# EAGLE design Zx81Composite (EAGLE 9.5.2)
ZX81 Composite modification With adjustable Black Level and Line Sync Done by Thanat0s - 2020 WTFPL Licence
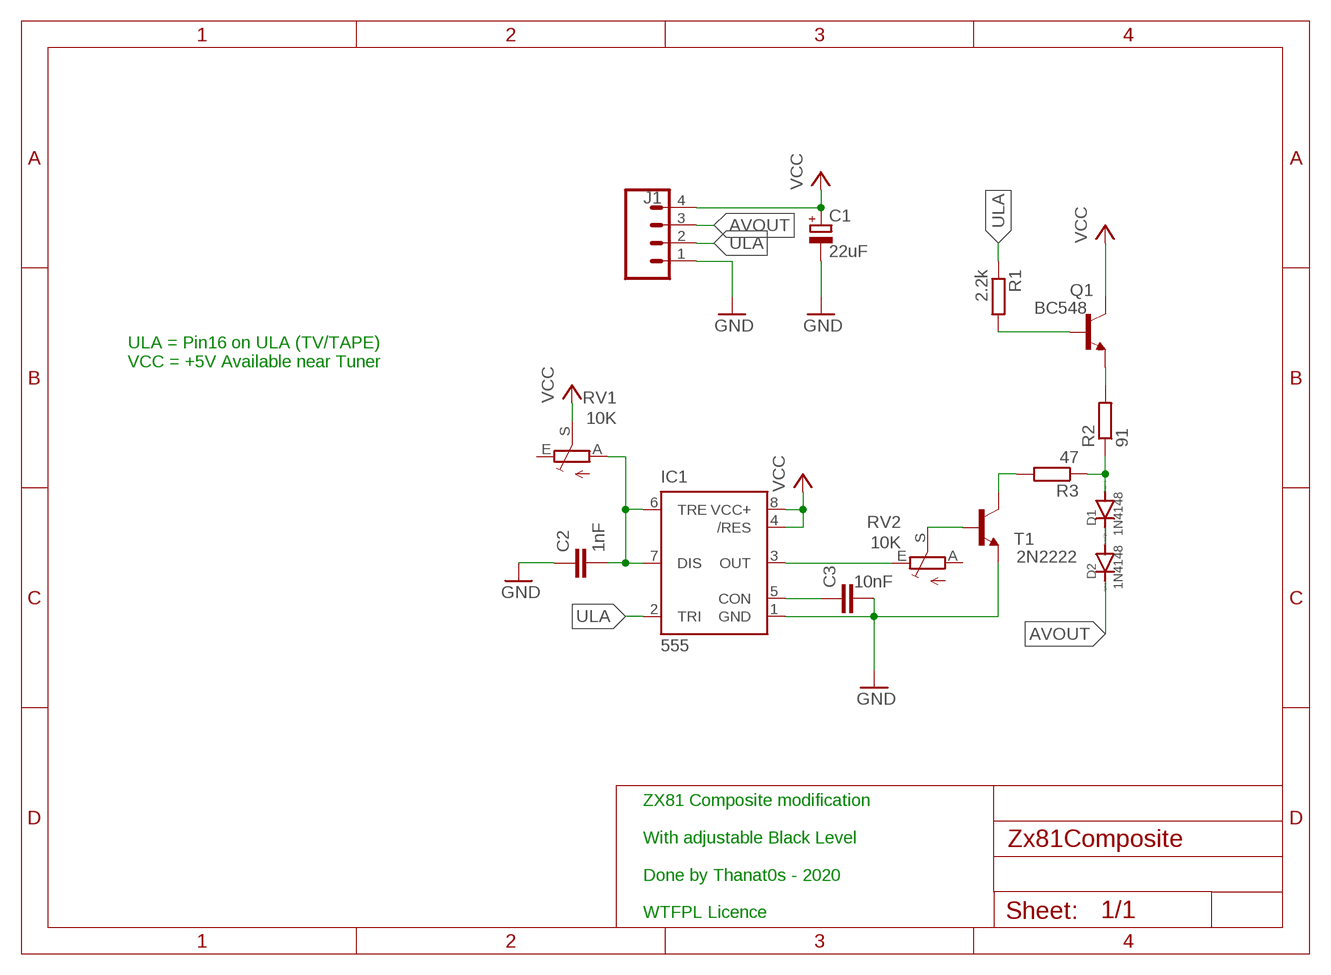
[diagram p0: schematic, sheet 1]

## Parts
C1  22uF  CPOL-EUE2.5-5  [E2,5-5]
C2  1nF  C-EU025-024X044  [C025-024X044]
C3  10nF  C-EU025-024X044  [C025-024X044]
D1  1N4148  1N4148DO35-7  [DO35-7]
D2  1N4148  1N4148DO35-7  [DO35-7]
IC1  555  555P  [DIP08]
J1  CONN_04  [1X04]
Q1  BC548  [TO92-EBC]
R1  2.2k  R-EU_0207/7  [0207/7]
R2  91  R-EU_0207/7  [0207/7]
R3  47  R-EU_0207/7  [0207/7]
RV1  10K  TRIM_EU-CA6V  [CA6V]
RV2  10K  TRIM_EU-CA6V  [CA6V]
T1  2N2222  [TO92-EBC-OVAL]

## Nets
AVOUT: D2.C J1.3
GND: C1.- C2.1 C3.2 IC1.1(GND) J1.1 T1.E
N$1: Q1.B R1.2
N$2: D1.C D2.A
N$3: RV2.S T1.B
N$4: C3.1 IC1.5(CON)
N$5: C2.2 IC1.6(TRE) IC1.7(DIS) RV1.A
N$6: IC1.3(OUT) RV2.E
N$7: D1.A R2.1 R3.1
N$8: R3.2 T1.C
N$11: Q1.E R2.2
ULA: IC1.2(TRI) J1.2 R1.1
VCC: C1.+ IC1.4(/RES) IC1.8(VCC+) J1.4 Q1.C RV1.S
Unconnected: RV1.E RV2.A

## Notes on the sheet
- ULA = Pin16 on ULA (TV/TAPE)
  VCC = +5V Available near Tuner
- ZX81 Composite modification
  
  With adjustable Black Level
  
  Done by Thanat0s - 2020
  
  WTFPL Licence

## Library data of the parts
C1 = rcl:CPOL-EU: POLARIZED CAPACITOR, European symbol; SPICEPREFIX: C
C2 C3 = rcl:C-EU: CAPACITOR, European symbol; SPICEPREFIX: C
D1 D2 = diode:1N4148: DIODE high speed (Philips)
IC1 = SparkFun-IC-Special-Function:555: General purpose bipolar Timer Datasheet <http://www.sparkfun.com/datasheets/Components/General/ne555.pdf> SparkFun Products SparkFun SparkPunk Sequencer Kit <https://www.sparkfun.com/products/12707> (KIT-12707) Storefront Component: 555 Timer <https://www.sparkfun.com/products/9273> (COM-09273) Two parts valid for production: VFP: IC-11930 (M7555 PTH) VFP: IC-09173 (555 PTH) - Preferred; PROD_ID: IC-09173; PROD_ID_ALT: IC-09173
J1 = SparkFun-Connectors:CONN_04: Multi connection point. Often used as Generic Header-pin footprint for 0.1 inch spaced/style header connections On any of the 0.1 inch spaced packages, you can populate with these: Break Away Headers - Straight <https://www.sparkfun.com/products/116> (PRT-00116) Break Away Male Headers - Right Angle <https://www.sparkfun.com/products/553> (PRT-00553) Female Headers <https://www.sparkfun.com/products/115> (PRT-00115) Break Away Headers - Machine Pin <https://www.sparkfun.com/products/117> (PRT-00117) Break Away Female Headers - Swiss Machine Pin <https://www.sparkfun.com/products/743> (PRT-00743) For SCREWTERMINALS and SPRING TERMINALS visit here: Screw Terimnals on SparkFun.com <https://www.sparkfun.com/search/results?term=Screw+Terminals> (5mm/3.5mm/2.54mm spacing) This device is also useful as a general connection point to wire up your design to another part of your project. Our various solder wires solder well into these plated through hole pads. Hook-Up Wire - Assortment (Stranded, 22 AWG) <https://www.sparkfun.com/products/11375> (PRT-11375) Hook-Up Wire - Assortment (Solid Core, 22 AWG) <https://www.sparkfun.com/products/11367> (PRT-11367) View the entire wire category on our website here <https://www.sparkfun.com/categories/141> Special notes: Molex polarized connector foot print use with SKU : PRT-08231 with associated crimp pins and housings. 1MM SMD Version SKU: PRT-10208; PROD_ID: CONN-09696
Q1 = transistor-npn:BC548*: NPN Transistor
R1-R3 = rcl:R-EU_: RESISTOR, European symbol; SPICEPREFIX: R
RV1 RV2 = pot:TRIM_EU-: POTENTIOMETER; SPICEPREFIX: J
T1 = adafruit:2N2222: NPN TRANSISTOR Big oval pads

## Board
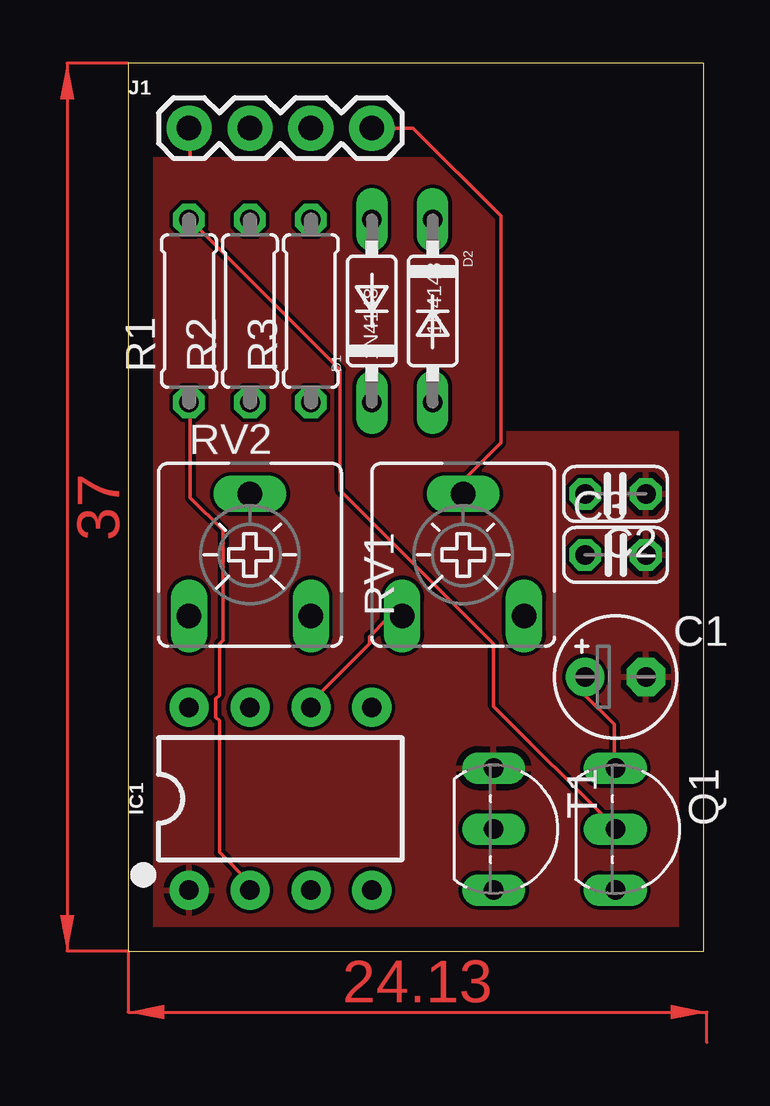
[diagram p1: board, top side]
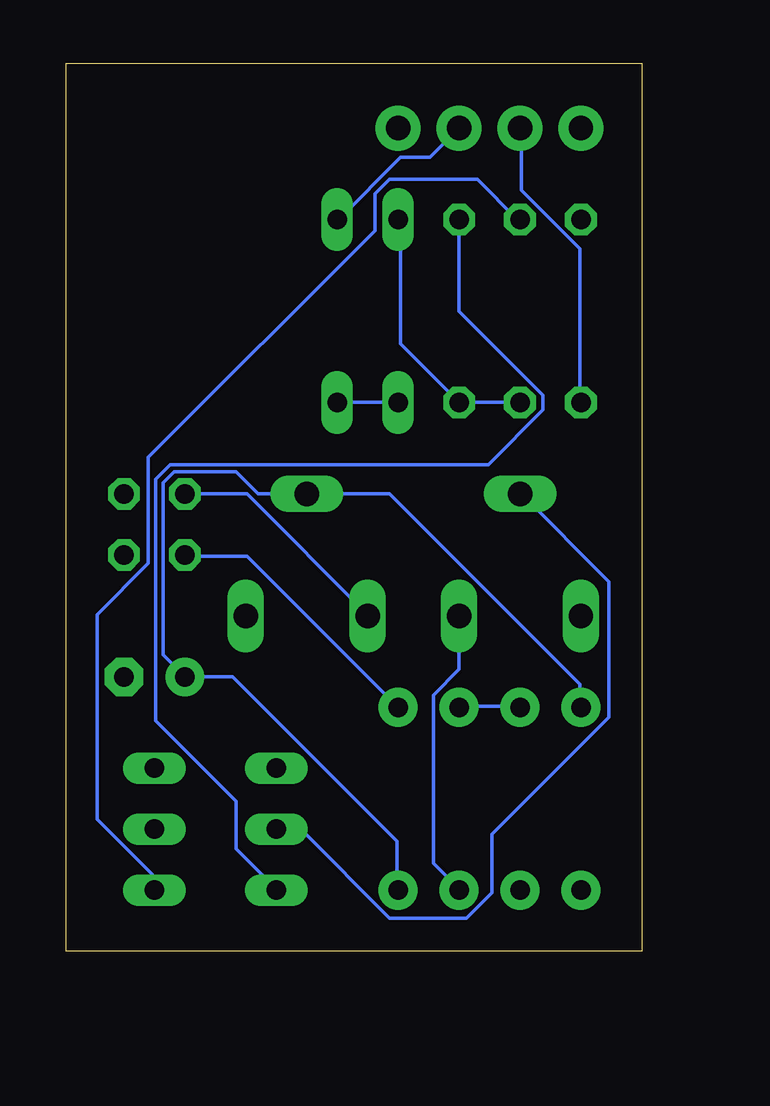
[diagram p2: board, bottom side, seen from below]

Size 24 x 37 mm. Coordinates in mm from the lower left corner, seen from the top.
Outline: 0,0 24,0 24,37 0,37 0,0
Copper layers (1*16): Top 0.035mm / dielectric 1.5mm / Bottom 0.035mm
Design rules "typon": minimum track width 6mil, minimum drill 0.35mm, track to track 6mil, track to pad 6mil, pad to pad 6mil, via to via 6mil, smd to smd 6mil, copper to edge 40mil, drill to drill 6mil, minimum pad ring 10mil, minimum via ring 8mil, stop-mask expansion 4mil, vias tented up to drill 0mil, thermal gap 10mil

### Footprints (pad centres in the part's own frame; a part is rotated, then mirrored left to right if it is on the bottom)
E2,5-5 = drill 0.813 pad 1.6: + -1.27,0 | drill 0.813 pad 1.6 octagon: - 1.27,0
C025-024X044 = drill 0.813 octagon: 1 -1.27,0; 2 1.27,0
DO35-7 = drill 0.813 long: A 3.81,0; C -3.81,0
DIP08 = drill 0.813 pad 1.626: 1 -3.81,-3.81; 2 -1.27,-3.81; 3 1.27,-3.81; 4 3.81,-3.81; 5 3.81,3.81; 6 1.27,3.81; 7 -1.27,3.81; 8 -3.81,3.81
1X04 = drill 1.016 pad 1.88: 1 0,0; 2 2.54,0; 3 5.08,0; 4 7.62,0
TO92-EBC = drill 0.813 long: B 0,-1.27; C -2.54,-1.27; E 2.54,-1.27
0207/7 = drill 0.813 octagon: 1 -3.81,0; 2 3.81,0
CA6V = drill 1.016 long: A -2.54,-2.54; E 2.54,-2.54; S 0,2.54
TO92-EBC-OVAL = drill 0.813 long: B 0,-1.27; C 2.54,-1.27; E -2.54,-1.27

### Placement (x,y rotation side)
C1  20.32,11.43 0 top
C2  20.32,19.05 180 top
C3  20.32,16.51 0 top
D1  10.16,26.67 90 top
D2  12.7,26.67 270 top
IC1  6.35,6.35 0 top
J1  2.54,34.29 0 top
Q1  21.59,5.08 270 top
R1  2.54,26.67 90 top
R2  5.08,26.67 90 top
R3  7.62,26.67 90 top
RV1  13.97,16.51 0 top
RV2  5.08,16.51 0 top
T1  16.51,5.08 270 top

### Tracks (layer width: path | path; a pad name or v marks a point on that pad's centre or on a via)
AVOUT
  Bottom 0.152: J1.3 8.84,33.07 10.06,33.07 12.65,30.48 D2.C
GND
  Top 0.152: 2.59,33.02 2.59,34.29 J1.1
  pour Top: 0,33.02 12.7,33.02 15.24,30.48 15.24,21.59 24.13,21.59 24.13,0 0,0
N$1
  Top 0.152: R1.2 2.59,30.48 8.84,24.23 8.84,19.2 15.24,12.8 15.24,10.21 20.27,5.18 Q1.B
N$2
  Bottom 0.152: D2.A D1.C
N$3
  Bottom 0.152: T1.B 15.24,5.03 14.17,5.03 10.52,1.37 7.32,1.37 6.25,2.44 6.25,4.88 1.37,9.75 1.37,15.39 5.03,19.05 RV2.S
N$4
  Bottom 0.152: IC1.5 16.46,16.46 19.05,16.46 C3.1
N$5
  Top 0.152: IC1.6 7.62,10.21 8.08,10.67 8.08,10.82 10.06,12.8 10.06,13.11 10.82,13.87 11.43,13.87 RV1.A
  Bottom 0.152: IC1.7 5.18,10.21 7.62,10.21 IC1.6 | C2.2 16.46,19.05 11.43,14.02 RV1.A
N$6
  Bottom 0.152: RV2.E 7.62,11.73 8.69,10.67 8.69,3.66 7.62,2.59 IC1.3
N$7
  Bottom 0.152: R2.1 R3.1 10.06,25.3 10.06,30.48 D1.A
N$8
  Bottom 0.152: R3.2 7.62,26.67 4.12,23.16 4.12,22.55 6.4,20.27 19.66,20.27 20.27,19.66 20.27,9.6 16.92,6.25 16.92,4.27 15.24,2.59 T1.C
N$11
  Bottom 0.152: Q1.E 20.42,2.59 20.42,3.2 22.71,5.49 22.71,14.02 20.57,16.15 20.57,20.57 11.12,30.02 11.12,31.55 10.52,32.16 6.86,32.16 5.18,30.48 R2.2
ULA
  Top 0.152: IC1.2 5.03,2.59 5.03,2.9 3.81,4.12 3.81,9.6 3.66,9.75 3.66,10.52 3.81,10.67 3.81,12.8 3.96,12.95 3.96,17.53 2.59,18.9 2.59,22.86 R1.1
  Bottom 0.152: R1.1 2.59,22.86 2.59,29.26 5.03,31.7 5.03,34.29 J1.2
VCC
  Top 0.152: C1.+ 19.05,10.67 20.27,9.45 20.27,7.62 Q1.C | J1.4 11.89,34.29 15.54,30.63 15.54,21.18 14.02,19.66 14.02,19.05 RV1.S
  Bottom 0.152: IC1.4 10.21,2.59 10.21,4.57 17.07,11.43 C1.+ 19.96,12.34 19.96,19.51 19.51,19.96 16.92,19.96 16,19.05 RV1.S 10.52,19.05 2.59,11.12 2.59,10.21 IC1.8
(copper drawn outside any net)
  shapes: Top area x2